# EAGLE design untitled (EAGLE 9.1.0)
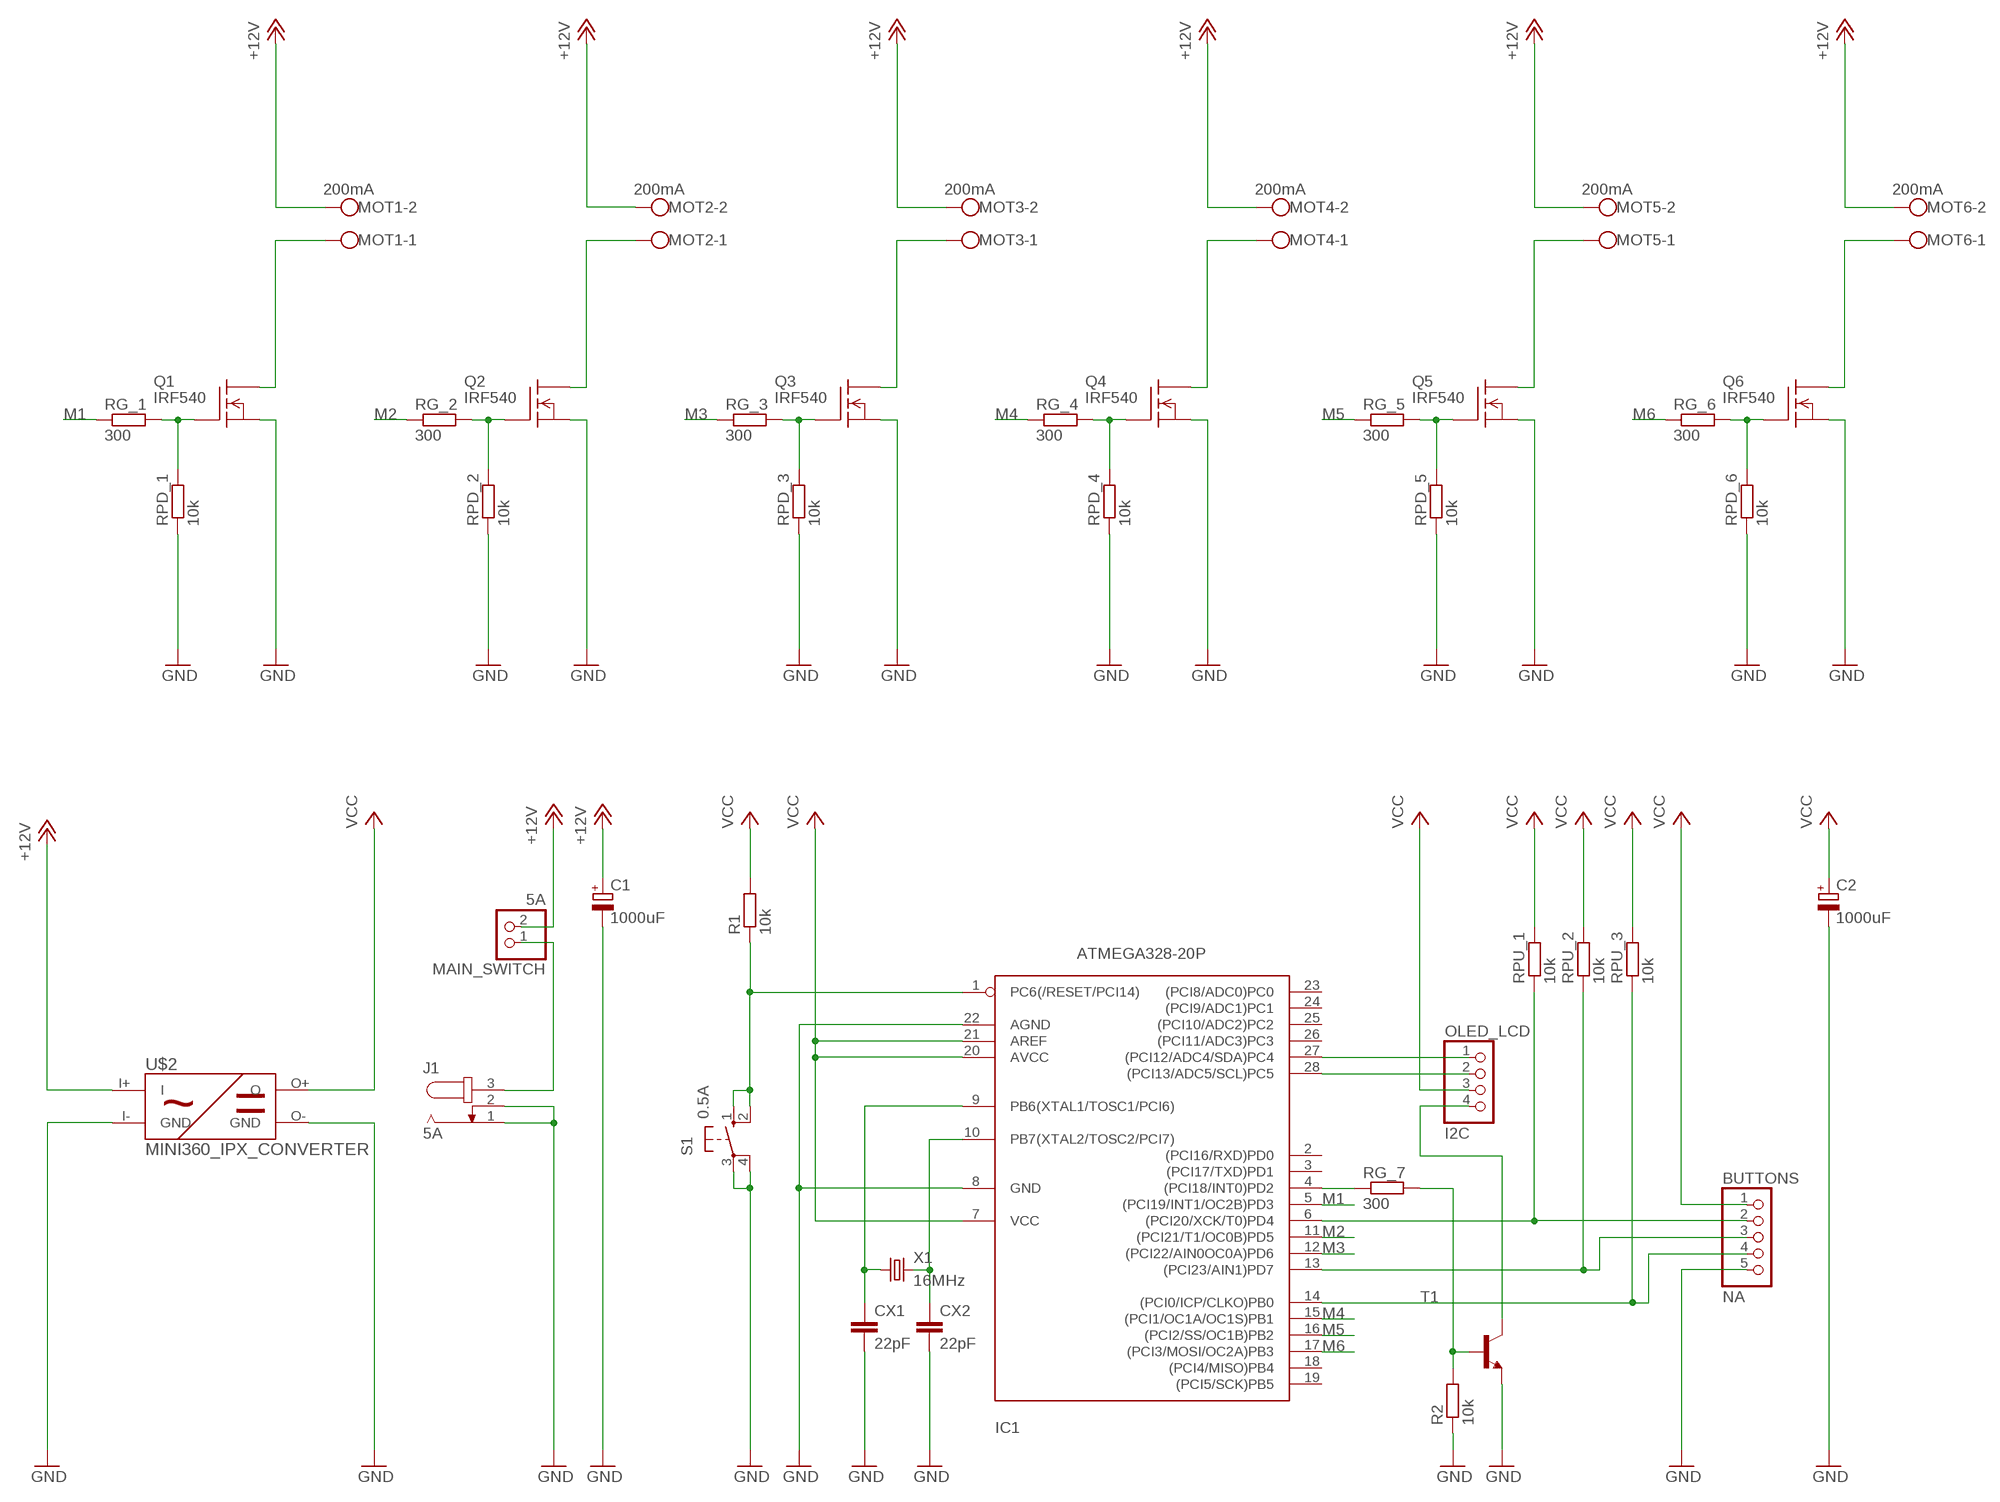
[diagram p0: schematic, sheet 1]

## Parts
BUTTONS  NA  PINHD-1X5  [1X05]
C1  1000uF  CPOL-EUE5-8.5  [E5-8,5]
C2  1000uF  CPOL-EUE5-8.5  [E5-8,5]
CX1  22pF  C-EU025-024X044  [C025-024X044]
CX2  22pF  C-EU025-024X044  [C025-024X044]
IC1  ATMEGA328-20P  [DIL28-3]
J1  5A  JACK-PLUG1  [SPC4078]
MAIN_SWITCH  5A  PINHD-1X2  [1X02]
MOT1  200mA  W237-102  [W237-102]
MOT2  200mA  W237-102  [W237-102]
MOT3  200mA  W237-102  [W237-102]
MOT4  200mA  W237-102  [W237-102]
MOT5  200mA  W237-102  [W237-102]
MOT6  200mA  W237-102  [W237-102]
OLED_LCD  I2C  PINHD-1X4  [1X04]
Q1  IRF540  [TO220]
Q2  IRF540  [TO220]
Q3  IRF540  [TO220]
Q4  IRF540  [TO220]
Q5  IRF540  [TO220]
Q6  IRF540  [TO220]
R1  10k  R-EU_0207/10  [0207/10]
R2  10k  R-EU_0207/10  [0207/10]
RG_1  300  R-EU_0207/10  [0207/10]
RG_2  300  R-EU_0207/10  [0207/10]
RG_3  300  R-EU_0207/10  [0207/10]
RG_4  300  R-EU_0207/10  [0207/10]
RG_5  300  R-EU_0207/10  [0207/10]
RG_6  300  R-EU_0207/10  [0207/10]
RG_7  300  R-EU_0207/10  [0207/10]
RPD_1  10k  R-EU_0207/10  [0207/10]
RPD_2  10k  R-EU_0207/10  [0207/10]
RPD_3  10k  R-EU_0207/10  [0207/10]
RPD_4  10k  R-EU_0207/10  [0207/10]
RPD_5  10k  R-EU_0207/10  [0207/10]
RPD_6  10k  R-EU_0207/10  [0207/10]
RPU_1  10k  R-EU_0207/10  [0207/10]
RPU_2  10k  R-EU_0207/10  [0207/10]
RPU_3  10k  R-EU_0207/10  [0207/10]
S1  0.5A  10-XX  [B3F-10XX]
T1  2N5551-NPN-TO92-CBE  [TO92-CBE]
U$2  MINI360_IPX_CONVERTER  [MINI360_IPX_CONVERTER]
X1  16MHz  CRYSTALHC49S  [HC49/S]

## Nets
+12V: C1.+ MAIN_SWITCH.2 MOT1.2 MOT2.2 MOT3.2 MOT4.2 MOT5.2 MOT6.2 U$2.I+(I)
GND: BUTTONS.5 C1.- C2.- CX1.2 CX2.2 IC1.8(GND) IC1.22(AGND) J1.1 J1.2 Q1.3(S) Q2.3(S) Q3.3(S) Q4.3(S) Q5.3(S) Q6.3(S) R2.1 RPD_1.1 RPD_2.1 RPD_3.1 RPD_4.1 RPD_5.1 RPD_6.1 S1.3(P) S1.4(P1) T1.E U$2.I-(GND) U$2.O-(GND)
M1: IC1.5((PCI19/INT1/OC2B)PD3) RG_1.1
M2: IC1.11((PCI21/T1/OC0B)PD5) RG_2.1
M3: IC1.12((PCI22/AIN0OC0A)PD6) RG_3.1
M4: IC1.15((PCI1/OC1A/OC1S)PB1) RG_4.1
M5: IC1.16((PCI2/SS/OC1B)PB2) RG_5.1
M6: IC1.17((PCI3/MOSI/OC2A)PB3) RG_6.1
N$1: IC1.1(PC6(/RESET/PCI14)) R1.1 S1.1(S) S1.2(S1)
N$2: CX1.1 IC1.9(PB6(XTAL1/TOSC1/PCI6)) X1.1
N$3: CX2.1 IC1.10(PB7(XTAL2/TOSC2/PCI7)) X1.2
N$4: Q1.1(G) RG_1.2 RPD_1.2
N$5: Q2.1(G) RG_2.2 RPD_2.2
N$6: MOT1.1 Q1.2(D)
N$7: MOT2.1 Q2.2(D)
N$8: Q3.1(G) RG_3.2 RPD_3.2
N$9: MOT3.1 Q3.2(D)
N$10: Q4.1(G) RG_4.2 RPD_4.2
N$11: MOT4.1 Q4.2(D)
N$12: Q5.1(G) RG_5.2 RPD_5.2
N$13: MOT5.1 Q5.2(D)
N$14: Q6.1(G) RG_6.2 RPD_6.2
N$15: MOT6.1 Q6.2(D)
N$16: IC1.27((PCI12/ADC4/SDA)PC4) OLED_LCD.1
N$17: IC1.28((PCI13/ADC5/SCL)PC5) OLED_LCD.2
N$18: BUTTONS.2 IC1.6((PCI20/XCK/T0)PD4) RPU_1.1
N$19: BUTTONS.3 IC1.13((PCI23/AIN1)PD7) RPU_2.1
N$20: BUTTONS.4 IC1.14((PCI0/ICP/CLKO)PB0) RPU_3.1
N$21: J1.3 MAIN_SWITCH.1
N$22: OLED_LCD.4 T1.C
N$23: IC1.4((PCI18/INT0)PD2) RG_7.1
N$24: R2.2 RG_7.2 T1.B
VCC: BUTTONS.1 C2.+ IC1.7(VCC) IC1.20(AVCC) IC1.21(AREF) OLED_LCD.3 R1.2 RPU_1.2 RPU_2.2 RPU_3.2 U$2.O+(O)
Unconnected: IC1.2((PCI16/RXD)PD0) IC1.3((PCI17/TXD)PD1) IC1.18((PCI4/MISO)PB4) IC1.19((PCI5/SCK)PB5) IC1.23((PCI8/ADC0)PC0) IC1.24((PCI9/ADC1)PC1) IC1.25((PCI10/ADC2)PC2) IC1.26((PCI11/ADC3)PC3)

## Library data of the parts
BUTTONS = pinhead:PINHD-1X5: PIN HEADER
C1 C2 = rcl:CPOL-EU: POLARIZED CAPACITOR, European symbol; SPICEPREFIX: C
CX1 CX2 = resistor:C-EU: CAPACITOR, European symbol
IC1 = atmega328:ATMEGA328*P: MICROCONTROLLER 32 kBytes FLASH 2 kBytes SRAM 1 kBytes EEPROM USART 8-channel 10 bit ADC
J1 = con-jack:JACK-PLUG: DC POWER JACK Power Jack, DC, Right Angle, Through Hole, Rated 5A at 16VDC, PC Terminals Distributor: Farnell (www.Farnell.de) Drawing: 84N1161.pdf / 84N1162.pdf Manufacturer: SPC Technology (www.spctechnology.com) Type: SPC4077 / SPC 4078; OC_FARNELL: unknown; OC_NEWARK: unknown
MAIN_SWITCH = pinhead:PINHD-1X2: PIN HEADER
MOT1-MOT6 = con-wago-500:W237-102: WAGO SCREW CLAMP; MPN: 237-102; OC_FARNELL: unknown; OC_NEWARK: 70K9898
OLED_LCD = pinhead:PINHD-1X4: PIN HEADER
Q1-Q6 = transistor-fet:IRF540: N-Channel Enhancement MOSFET (HEXFET); 100V; 28A; 0,077Ohm
R1 R2 RG_1-RG_7 RPD_1-RPD_6 RPU_1-RPU_3 = rcl:R-EU_: RESISTOR, European symbol; SPICEPREFIX: R
S1 = switch-omron:10-XX: OMRON SWITCH; MPN: B3F-1000; OC_FARNELL: 176432; OC_NEWARK: 36M3542
T1 = transistor:*-NPN-: NPN Transistror BF959 corrected 2008.03.06
U$2 = ipx_lib:MINI360_IPX_CONVERTER: MINI360 Buck converter
X1 = crystal:CRYSTAL: CRYSTAL; OC_FARNELL: 1667008; OC_NEWARK: unknown

## Board
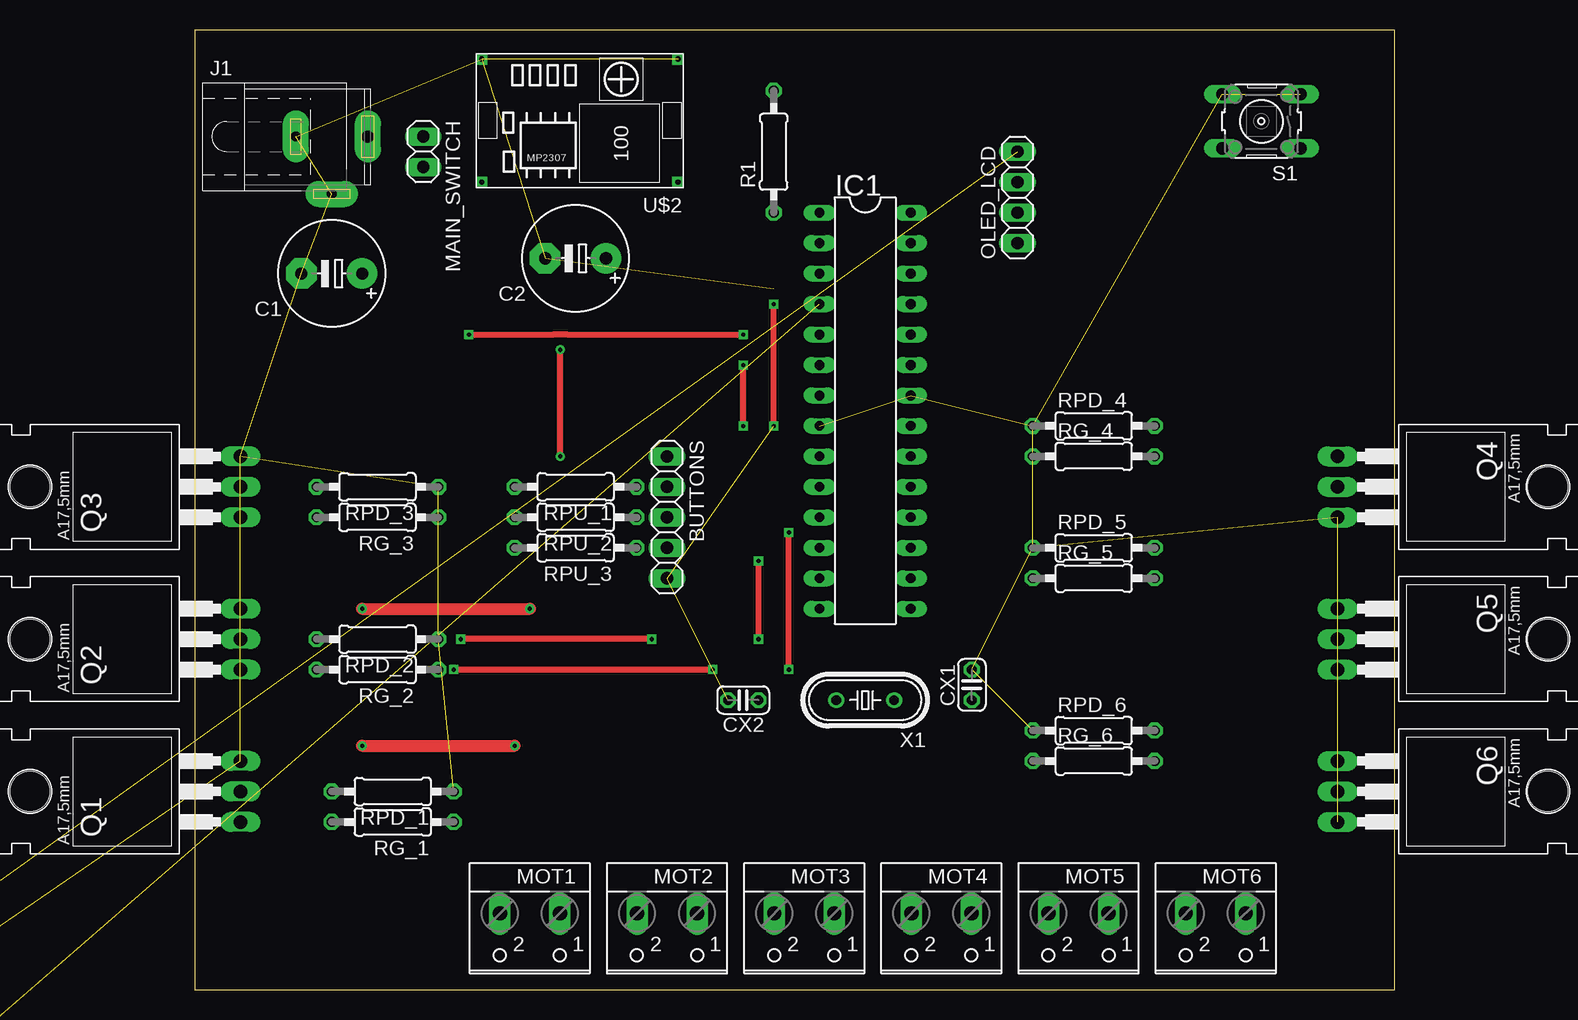
[diagram p1: board, top side]
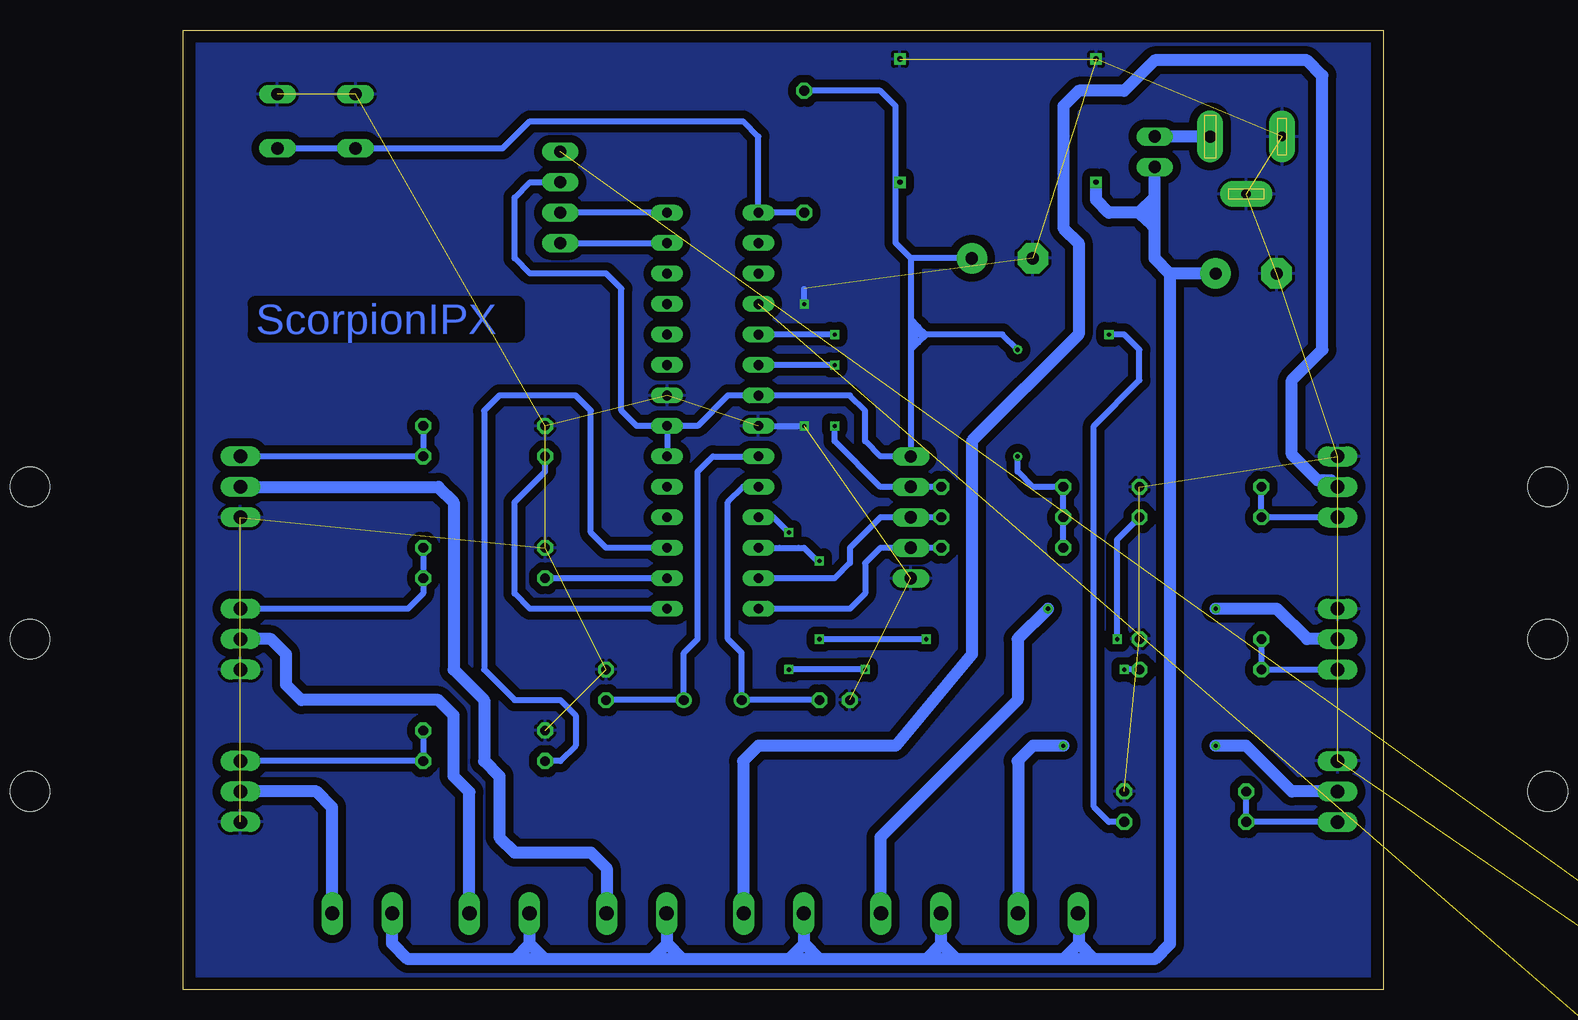
[diagram p2: board, bottom side, seen from below]

Size 100 x 80 mm. Coordinates in mm from the lower left corner, seen from the top.
Outline: 0,0 100,0 100,80 0,80 0,0
Copper layers (1*16): Top 0.035mm / dielectric 1.5mm / Bottom 0.035mm
Design rules "default *": minimum track width 6mil, minimum drill 0.35mm, track to track 26mil, track to pad 26mil, pad to pad 26mil, via to via 26mil, smd to smd 6mil, copper to edge 40mil, drill to drill 6mil, minimum pad ring 10mil, minimum via ring 8mil, stop-mask expansion 4mil, vias tented up to drill 0mil, thermal gap 10mil

### Footprints (pad centres in the part's own frame; a part is rotated, then mirrored left to right if it is on the bottom)
1X05 = drill 1.016 long: 1 -5.08,0; 2 -2.54,0; 3 0,0; 4 2.54,0; 5 5.08,0
E5-8,5 = drill 1.016 pad 2.54: + -2.54,0 | drill 1.016 pad 2.54 octagon: - 2.54,0
C025-024X044 = drill 0.813 octagon: 1 -1.27,0; 2 1.27,0
DIL28-3 = drill 0.813 long: 1 -16.51,-3.81; 2 -13.97,-3.81; 3 -11.43,-3.81; 4 -8.89,-3.81; 5 -6.35,-3.81; 6 -3.81,-3.81; 7 -1.27,-3.81; 8 1.27,-3.81; 9 3.81,-3.81; 10 6.35,-3.81; 11 8.89,-3.81; 12 11.43,-3.81; 13 13.97,-3.81; 14 16.51,-3.81; 15 16.51,3.81; 16 13.97,3.81; 17 11.43,3.81; 18 8.89,3.81; 19 6.35,3.81; 20 3.81,3.81; 21 1.27,3.81; 22 -1.27,3.81; 23 -3.81,3.81; 24 -6.35,3.81; 25 -8.89,3.81; 26 -11.43,3.81; 27 -13.97,3.81; 28 -16.51,3.81
SPC4078 = drill 0.8 pad 2.184 long: 1 -3,0; 2 0,-4.8 | drill 1 pad 2.184 long: 3 3,0
1X02 = drill 1.016 long: 1 -1.27,0; 2 1.27,0
W237-102 = drill 1.194 long: 1 -2.5,-1.27; 2 2.5,-1.27
1X04 = drill 1.016 long: 1 -3.81,0; 2 -1.27,0; 3 1.27,0; 4 3.81,0
TO220 = drill 1.118 long: 1 -2.54,-6.35; 2 0,-6.35; 3 2.54,-6.35 | hole 3.302: 0,11.176
0207/10 = drill 0.813 octagon: 1 -5.08,0; 2 5.08,0
B3F-10XX = drill 1.016 long: 1 -3.251,2.261; 2 3.251,2.261; 3 -3.251,-2.261; 4 3.251,-2.261
TO92-CBE = drill 0.813 long: B 0,0; C -2.54,0; E 2.54,0
MINI360_IPX_CONVERTER = drill 0.45 pad 0.813 square: I+ 7.823,5.08; I- 7.823,-5.182; O+ -8.534,5.08; O- -8.534,-5.182
HC49/S = drill 0.813: 1 -2.413,0; 2 2.413,0

### Placement (x,y rotation side)
BUTTONS  39.37,39.37 270 top
C1  11.43,59.69 180 top
C2  31.75,60.96 180 top
CX1  64.77,25.4 90 top
CX2  45.72,24.13 180 top
IC1  55.88,48.26 270 top
J1  11.43,71.12 0 top
MAIN_SWITCH  19.05,69.85 270 top
MOT1  27.94,5.08 180 top
MOT2  39.37,5.08 180 top
MOT3  50.8,5.08 180 top
MOT4  62.23,5.08 180 top
MOT5  73.66,5.08 180 top
MOT6  85.09,5.08 180 top
OLED_LCD  68.58,66.04 90 top
Q1  -2.54,16.51 90 top
Q2  -2.54,29.21 90 top
Q3  -2.54,41.91 90 top
Q4  101.6,41.91 270 top
Q5  101.6,29.21 270 top
Q6  101.6,16.51 270 top
R1  48.26,69.85 90 top
R2  -20.32,-5.08 0 top  (outside the outline)
RG_1  16.51,13.97 180 top
RG_2  15.24,26.67 180 top
RG_3  15.24,39.37 180 top
RG_4  74.93,44.45 0 top
RG_5  74.93,34.29 0 top
RG_6  74.93,19.05 0 top
RG_7  -20.32,-10.16 0 top  (outside the outline)
RPD_1  16.51,16.51 180 top
RPD_2  15.24,29.21 180 top
RPD_3  15.24,41.91 180 top
RPD_4  74.93,46.99 0 top
RPD_5  74.93,36.83 0 top
RPD_6  74.93,21.59 0 top
RPU_1  31.75,41.91 180 top
RPU_2  31.75,39.37 180 top
RPU_3  31.75,36.83 180 top
S1  88.9,72.39 180 top
T1  -22.86,2.54 0 top  (outside the outline)
U$2  31.75,72.39 180 top
X1  55.88,24.13 180 top

### Tracks (layer width: path | path; a pad name or v marks a point on that pad's centre or on a via)
+12V
  Bottom 1.016: C1.+ 17.78,59.69 | 17.78,59.69 19.05,60.96 19.05,63.5 | 19.05,63.5 19.05,64.77 | 19.05,64.77 19.05,66.04 | 19.05,66.04 MAIN_SWITCH.2 | 19.05,66.04 20.32,64.77 | 20.32,64.77 19.68,64.14 | 19.68,64.14 19.05,63.5 | 19.05,64.77 19.68,64.14 | 17.78,59.69 17.78,3.81 19.05,2.54 24.13,2.54 | 24.13,2.54 26.67,2.54 | 26.67,2.54 35.56,2.54 | 35.56,2.54 38.1,2.54 | 38.1,2.54 46.99,2.54 | 46.99,2.54 49.53,2.54 | 49.53,2.54 58.42,2.54 | 58.42,2.54 60.96,2.54 | 60.96,2.54 69.85,2.54 | 69.85,2.54 72.39,2.54 | 72.39,2.54 81.28,2.54 82.59,3.85 MOT6.2 | MOT1.2 25.4,6.31 25.4,3.81 | 25.4,3.81 24.13,2.54 | 25.4,3.81 26.67,2.54 | MOT2.2 36.87,3.85 | 36.87,3.85 35.56,2.54 | 36.87,3.85 36.87,3.77 38.1,2.54 | MOT3.2 48.3,3.85 | 48.3,3.85 46.99,2.54 | 48.3,3.85 48.3,3.77 49.53,2.54 | MOT4.2 59.73,3.85 | 59.73,3.85 58.42,2.54 | 59.73,3.85 59.73,3.77 60.96,2.54 | MOT5.2 71.16,3.85 | 71.16,3.85 69.85,2.54 | 71.16,3.85 71.16,3.77 72.39,2.54 | 20.32,64.77 22.86,64.77 23.93,65.84 U$2.I+
GND  (via drill 0.35)  (26 unrouted)
  Top 0.508: v48.26,46.99 v48.26,57.15
  Bottom 0.508: IC1.8 v48.26,46.99 | v48.26,57.15 48.26,58.42
  pour Bottom: -1.27,80.01 101.6,81.28 101.6,0 102.87,-1.27 -1.27,-1.27
M1  (via drill 0.35)
  Top 0.508: v22.86,54.61 29.92,54.61 29.95,54.63 31.02,54.63 31.04,54.61 v45.72,54.61
  Bottom 0.508: RG_1.1 22.86,13.97 24.13,15.24 24.13,46.99 20.32,50.8 20.32,53.34 21.59,54.61 v22.86,54.61 | v45.72,54.61 IC1.5
M2  (via drill 0.35)
  Top 0.508: v21.59,26.67 v43.18,26.67 | v49.53,26.67 v49.53,38.1
  Bottom 0.508: RG_2.1 v21.59,26.67 | v43.18,26.67 v49.53,26.67 | v49.53,38.1 50.8,39.37 IC1.11
M3  (via drill 0.35)
  Top 0.508: v46.99,35.74 v46.99,29.21 | v38.1,29.21 v22.18,29.21
  Bottom 0.508: IC1.12 50.31,36.83 50.29,36.81 48.77,36.81 48.75,36.83 48.26,36.83 47.17,35.74 v46.99,35.74 | v22.18,29.21 22.18,37.51 RG_3.1 | v46.99,29.21 v38.1,29.21
M4
  Bottom 0.508: IC1.15 71.12,31.75 72.39,33.02 72.39,40.64 69.85,43.18 RG_4.1
M5
  Bottom 0.508: IC1.16 RG_5.1
M6
  Bottom 0.508: IC1.17 64.77,36.83 66.04,38.1 66.04,48.26 67.31,49.53 73.66,49.53 74.93,48.26 74.93,26.67 72.39,24.13 68.58,24.13 67.31,22.86 67.31,20.32 68.58,19.05 RG_6.1
N$1
  Bottom 0.508: R1.1 IC1.1 52.07,71.12 53.34,72.39 71.12,72.39 73.38,70.13 85.09,70.13 S1.2 S1.1
N$2
  Bottom 0.508: IC1.9 55.88,44.45 57.15,43.18 57.15,29.21 58.29,28.07 X1.1 CX1.1
N$3
  Bottom 0.508: IC1.10 53.34,41.91 54.61,40.64 54.61,29.21 53.47,28.07 X1.2 CX2.1
N$4
  Bottom 0.508: Q1.1 RG_1.2 RPD_1.2
N$5
  Bottom 0.508: RPD_2.2 RG_2.2 Q2.1
N$6  (via drill 0.35)
  Top 1.016: v13.97,20.32 v26.67,20.32
  Bottom 1.016: Q1.2 7.62,16.51 11.43,20.32 v13.97,20.32 | v26.67,20.32 29.21,20.32 30.48,19.05 30.44,19.01 MOT1.1
N$7  (via drill 0.35)
  Top 1.016: v13.97,31.75 v27.94,31.75
  Bottom 1.016: Q2.2 6.35,29.21 8.89,31.75 v13.97,31.75 | v27.94,31.75 30.48,29.21 30.48,24.13 41.91,12.7 41.91,6.35 MOT2.1
N$8
  Bottom 0.508: Q3.1 RG_3.2 RPD_3.2
N$9
  Bottom 1.016: Q3.2 4.34,42.44 5.48,42.44 7.62,44.58 7.62,50.8 5.08,53.34 5.08,76.2 6.35,77.47 19.05,77.47 21.59,74.93 25.4,74.93 26.67,73.66 26.67,63.5 25.4,62.23 25.4,54.61 34.29,45.72 34.29,27.94 40.64,20.32 52.07,20.32 53.34,19.05 53.34,6.39 MOT3.1
N$10
  Bottom 0.508: RPD_4.2 RG_4.2 Q4.1
N$11
  Bottom 1.016: Q4.2 78.74,41.91 77.47,40.64 77.47,26.67 74.93,24.13 74.93,19.05 73.66,17.78 73.66,12.7 72.39,11.43 66.04,11.43 64.73,10.12 MOT4.1
N$12
  Bottom 0.508: RPD_5.2 RG_5.2 80.01,33.02 81.28,31.75 Q5.1
N$13
  Bottom 1.016: MOT5.1 76.16,16.47 77.47,17.78 77.47,22.86 78.74,24.13 90.17,24.13 91.44,25.4 91.44,27.94 92.71,29.21 Q5.2
N$14
  Bottom 0.508: RPD_6.2 RG_6.2 Q6.1
N$15
  Bottom 1.016: MOT6.1 87.59,15.2 88.9,16.51 Q6.2
N$16
  Bottom 0.508: OLED_LCD.1 IC1.27
N$17
  Bottom 0.508: IC1.28 OLED_LCD.2
N$18  (via drill 0.35)
  Top 0.508: v45.72,46.99 v45.72,52.07
  Bottom 0.508: RPU_1.1 BUTTONS.2 41.91,41.91 45.72,45.72 v45.72,46.99 | v45.72,52.07 IC1.6
N$19
  Bottom 0.508: RPU_2.1 BUTTONS.3 41.91,39.37 44.45,36.83 44.45,35.56 45.72,34.29 IC1.13
N$20
  Bottom 0.508: RPU_3.1 BUTTONS.4 41.91,36.83 43.18,35.56 43.18,33.02 44.45,31.75 IC1.14
N$21
  Bottom 1.016: J1.3 MAIN_SWITCH.1
N$22  (1 unrouted)
N$23  (1 unrouted)
N$24  (2 unrouted)
VCC  (via drill 0.35)
  Top 0.508: v30.48,44.45 v30.48,53.34
  Bottom 0.508: U$2.O+ 40.64,67.67 | 40.64,67.67 40.64,73.66 41.91,74.93 R1.2 | C2.+ 39.37,60.96 | 39.37,60.96 40.64,62.23 40.64,67.67 | 39.37,60.96 39.37,55.88 | 39.37,55.88 39.37,54.61 | 39.37,54.61 39.37,53.34 | 39.37,53.34 BUTTONS.1 41.91,44.45 43.18,45.72 43.18,48.26 44.45,49.53 IC1.7 54.61,49.53 57.15,46.99 IC1.21 | IC1.21 IC1.20 | IC1.21 62.23,46.99 63.5,48.26 63.5,58.42 64.77,59.69 71.12,59.69 72.39,60.96 72.39,66.04 71.12,67.31 OLED_LCD.3 | RPU_3.2 RPU_2.2 RPU_1.2 29.21,41.91 30.48,43.18 v30.48,44.45 | v30.48,53.34 31.75,54.61 38.1,54.61 | 38.1,54.61 38.73,55.24 | 38.73,55.24 39.37,55.88 | 38.1,54.61 39.37,54.61 | 38.1,54.61 38.73,53.98 | 38.73,53.98 39.37,53.34 | 38.73,55.24 39.37,54.61 | 39.37,54.61 38.73,53.98

### Text on the board
Bottom: ScorpionIPX